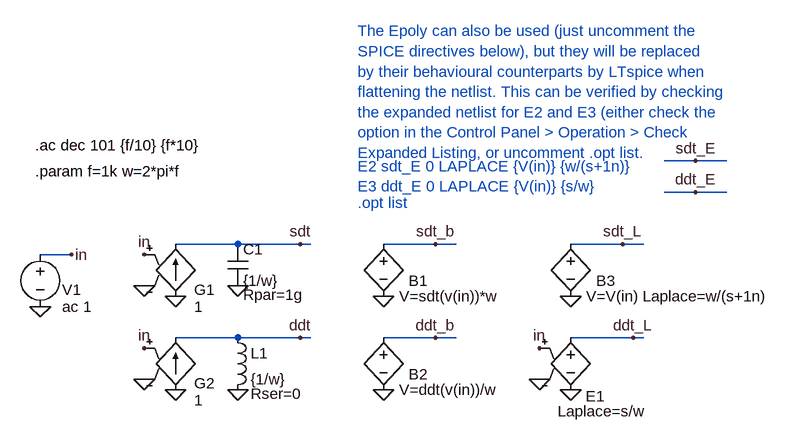
[diagram p0: schematic sdt,ddt.asc]
sdt,ddt.asc, the LTspice schematic file:
Version 4
SHEET 1 1108 680
WIRE 912 16 864 16
WIRE 960 16 912 16
WIRE 912 64 864 64
WIRE 960 64 912 64
WIRE 208 144 112 144
WIRE 304 144 208 144
WIRE 320 144 304 144
WIRE 512 144 432 144
WIRE 544 144 512 144
WIRE 800 144 720 144
WIRE 832 144 800 144
WIRE -48 160 -96 160
WIRE 208 288 112 288
WIRE 304 288 208 288
WIRE 320 288 304 288
WIRE 512 288 432 288
WIRE 544 288 512 288
WIRE 816 288 720 288
WIRE 832 288 816 288
FLAG 304 144 sdt
FLAG 208 208 0
FLAG 112 224 0
FLAG 64 208 0
FLAG -96 240 0
FLAG 304 288 ddt
FLAG 208 368 0
FLAG 112 368 0
FLAG 64 352 0
FLAG 432 224 0
FLAG 512 144 sdt_b
FLAG 432 368 0
FLAG 512 288 ddt_b
FLAG -48 160 in
FLAG 720 224 0
FLAG 800 144 sdt_L
FLAG 64 160 in
FLAG 64 304 in
FLAG 672 304 in
FLAG 720 368 0
FLAG 672 352 0
FLAG 816 288 ddt_L
FLAG 912 16 sdt_E
FLAG 912 64 ddt_E
SYMBOL g 112 128 R0
WINDOW 0 29 86 Left 2
WINDOW 3 29 112 Left 2
SYMATTR InstName G1
SYMATTR Value 1
SYMBOL cap 192 144 R0
WINDOW 123 24 78 Left 2
SYMATTR Value2 Rpar=1g
SYMATTR InstName C1
SYMATTR Value {1/w}
SYMBOL voltage -96 144 R0
WINDOW 0 34 70 Left 2
WINDOW 3 34 96 Left 2
SYMATTR InstName V1
SYMATTR Value ac 1
SYMBOL g 112 272 R0
WINDOW 0 29 86 Left 2
WINDOW 3 29 112 Left 2
SYMATTR InstName G2
SYMATTR Value 1
SYMBOL bv 432 128 R0
WINDOW 0 39 72 Left 2
SYMATTR InstName B1
SYMATTR Value V=sdt(v(in))*w
SYMBOL bv 432 272 R0
WINDOW 0 39 72 Left 2
SYMATTR InstName B2
SYMATTR Value V=ddt(v(in))/w
SYMBOL ind 192 272 R0
WINDOW 123 36 102 Left 2
SYMATTR Value2 Rser=0
SYMATTR InstName L1
SYMATTR Value {1/w}
SYMBOL bv 720 128 R0
WINDOW 0 39 72 Left 2
SYMATTR InstName B3
SYMATTR Value V=V(in) Laplace=w/(s+1n)
SYMBOL e 720 272 R0
WINDOW 0 23 106 Left 2
WINDOW 3 -20 129 Left 2
SYMATTR InstName E1
SYMATTR Value Laplace=s/w
TEXT -104 32 Left 2 !.param f=1k w=2*pi*f
TEXT -104 -8 Left 2 !.ac dec 101 {f/10} {f*10}
TEXT 392 -184 Left 2 ;The Epoly can also be used (just uncomment the\nSPICE directives below), but they will be replaced\nby their behavioural counterparts by LTspice when\nflattening the netlist. This can be verified by checking\nthe expanded netlist for E2 and E3 (either check the\noption in the Control Panel > Operation > Check\nExpanded Listing, or uncomment .opt list.
TEXT 392 24 Left 2 ;E2 sdt_E 0 LAPLACE {V(in)} {w/(s+1n)}\nE3 ddt_E 0 LAPLACE {V(in)} {s/w}
TEXT 392 80 Left 2 ;.opt list

The netlist it stands for:
* sdt,ddt.asc
G1 0 sdt in 0 1
C1 sdt 0 {1/w} Rpar=1g
V1 in 0 ac 1
G2 0 ddt in 0 1
B1 sdt_b 0 V=sdt(v(in))*w
B2 ddt_b 0 V=ddt(v(in))/w
L1 ddt 0 {1/w} Rser=0
B3 sdt_L 0 V=V(in) Laplace=w/(s+1n)
E1 ddt_L 0 in 0 Laplace=s/w
.param f=1k w=2*pi*f
.ac dec 101 {f/10} {f*10}
* The Epoly can also be used (just uncomment the
* SPICE directives below), but they will be replaced
* by their behavioural counterparts by LTspice when
* flattening the netlist. This can be verified by checking
* the expanded netlist for E2 and E3 (either check the
* option in the Control Panel > Operation > Check
* Expanded Listing, or uncomment .opt list.
* E2 sdt_E 0 LAPLACE {V(in)} {w/(s+1n)}
* E3 ddt_E 0 LAPLACE {V(in)} {s/w}
* .opt list
.backanno
.end